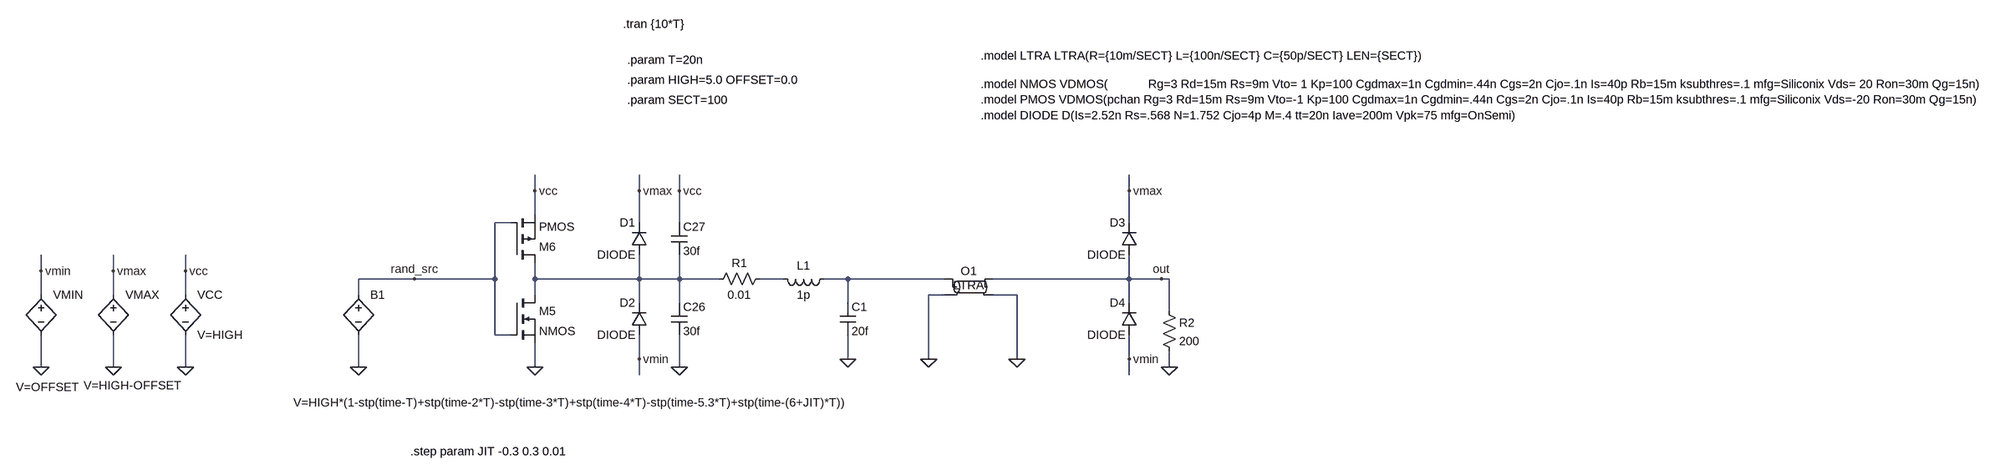
[diagram p0: schematic Test Nonlinearity.asc]
Test Nonlinearity.asc, the LTspice schematic file:
Version 4
SHEET 1 5848 2316
WIRE 384 -240 384 -272
WIRE 592 -240 592 -272
WIRE 672 -240 672 -272
WIRE 1616 -240 1616 -272
WIRE 384 -192 384 -240
WIRE 336 -176 304 -176
WIRE 592 -176 592 -240
WIRE 672 -176 672 -240
WIRE 1616 -176 1616 -240
WIRE -736 -80 -736 -112
WIRE -592 -80 -592 -112
WIRE -448 -80 -448 -112
WIRE 144 -64 32 -64
WIRE 304 -64 304 -176
WIRE 304 -64 144 -64
WIRE 384 -64 384 -96
WIRE 592 -64 592 -112
WIRE 592 -64 384 -64
WIRE 672 -64 672 -112
WIRE 672 -64 592 -64
WIRE 752 -64 672 -64
WIRE 880 -64 832 -64
WIRE 1008 -64 960 -64
WIRE 1248 -64 1008 -64
WIRE 1616 -64 1616 -112
WIRE 1616 -64 1344 -64
WIRE 1680 -64 1616 -64
WIRE 1696 -64 1680 -64
WIRE -736 -32 -736 -80
WIRE -592 -32 -592 -80
WIRE -448 -32 -448 -80
WIRE 32 -32 32 -64
WIRE 384 -32 384 -64
WIRE 1248 -32 1216 -32
WIRE 1392 -32 1344 -32
WIRE 592 -16 592 -64
WIRE 672 -16 672 -64
WIRE 1008 -16 1008 -64
WIRE 1616 -16 1616 -64
WIRE 1696 0 1696 -64
WIRE 304 48 304 -64
WIRE 336 48 304 48
WIRE 592 96 592 48
WIRE 1008 96 1008 48
WIRE 1216 96 1216 -32
WIRE 1392 96 1392 -32
WIRE 1616 96 1616 48
WIRE -736 112 -736 48
WIRE -592 112 -592 48
WIRE -448 112 -448 48
WIRE 32 112 32 48
WIRE 384 112 384 64
WIRE 672 112 672 48
WIRE 1696 112 1696 80
WIRE 592 128 592 96
WIRE 1616 128 1616 96
FLAG 1696 112 0
FLAG -448 112 0
FLAG -448 -80 vcc
FLAG 384 112 0
FLAG 1008 96 0
FLAG 672 112 0
FLAG -592 112 0
FLAG -592 -80 vmax
FLAG -736 112 0
FLAG -736 -80 vmin
FLAG 1216 96 0
FLAG 1392 96 0
FLAG 592 -240 vmax
FLAG 592 96 vmin
FLAG 384 -240 vcc
FLAG 672 -240 vcc
FLAG 1616 -240 vmax
FLAG 1616 96 vmin
FLAG 144 -64 rand_src
FLAG 1680 -64 out
FLAG 32 112 0
SYMBOL nmos 336 -32 R0
SYMATTR InstName M5
SYMBOL pmos 336 -96 M180
SYMATTR InstName M6
SYMBOL ind 976 -80 R90
WINDOW 0 5 56 VBottom 2
WINDOW 3 32 56 VTop 2
SYMATTR InstName L1
SYMATTR Value 1p
SYMBOL cap 992 -16 R0
SYMATTR InstName C1
SYMATTR Value 20f
SYMBOL res 848 -80 R90
WINDOW 0 0 56 VBottom 2
WINDOW 3 32 56 VTop 2
SYMATTR InstName R1
SYMATTR Value 0.01
SYMBOL diode 608 -112 R180
WINDOW 0 24 64 Left 2
WINDOW 3 24 0 Left 2
SYMATTR InstName D1
SYMATTR Value DIODE
SYMBOL cap 656 -16 R0
SYMATTR InstName C26
SYMATTR Value 30f
SYMBOL cap 656 -176 R0
SYMATTR InstName C27
SYMATTR Value 30f
SYMBOL ltline 1296 -48 R0
WINDOW 3 0 12 Bottom 2
SYMATTR InstName O1
SYMBOL bv -448 -48 R0
SYMATTR InstName VCC
SYMATTR Value V=HIGH
SYMBOL bv -592 -48 R0
WINDOW 3 -59 197 Left 2
SYMATTR Value V=HIGH-OFFSET
SYMATTR InstName VMAX
SYMBOL bv -736 -48 R0
WINDOW 3 -50 200 Left 2
SYMATTR Value V=OFFSET
SYMATTR InstName VMIN
SYMBOL diode 608 48 R180
WINDOW 0 24 64 Left 2
WINDOW 3 24 0 Left 2
SYMATTR InstName D2
SYMATTR Value DIODE
SYMBOL res 1680 -16 R0
SYMATTR InstName R2
SYMATTR Value 200
SYMBOL diode 1632 -112 R180
WINDOW 0 24 64 Left 2
WINDOW 3 24 0 Left 2
SYMATTR InstName D3
SYMATTR Value DIODE
SYMBOL diode 1632 48 R180
WINDOW 0 24 64 Left 2
WINDOW 3 24 0 Left 2
SYMATTR InstName D4
SYMATTR Value DIODE
SYMBOL bv 32 -48 R0
WINDOW 3 -130 231 Left 2
SYMATTR InstName B1
SYMATTR Value V=HIGH*(1-stp(time-T)+stp(time-2*T)-stp(time-3*T)+stp(time-4*T)-stp(time-5.3*T)+stp(time-(6+JIT)*T))
TEXT 1320 -656 Left 2 !.model LTRA LTRA(R={10m/SECT} L={100n/SECT} C={50p/SECT} LEN={SECT})
TEXT 1320 -600 Left 2 !.model NMOS VDMOS(            Rg=3 Rd=15m Rs=9m Vto= 1 Kp=100 Cgdmax=1n Cgdmin=.44n Cgs=2n Cjo=.1n Is=40p Rb=15m ksubthres=.1 mfg=Siliconix Vds= 20 Ron=30m Qg=15n)\n.model PMOS VDMOS(pchan Rg=3 Rd=15m Rs=9m Vto=-1 Kp=100 Cgdmax=1n Cgdmin=.44n Cgs=2n Cjo=.1n Is=40p Rb=15m ksubthres=.1 mfg=Siliconix Vds=-20 Ron=30m Qg=15n)\n.model DIODE D(Is=2.52n Rs=.568 N=1.752 Cjo=4p M=.4 tt=20n Iave=200m Vpk=75 mfg=OnSemi)
TEXT 560 -720 Left 2 !.tran {10*T}
TEXT 568 -648 Left 2 !.param T=20n
TEXT 568 -608 Left 2 !.param HIGH=5.0 OFFSET=0.0
TEXT 568 -568 Left 2 !.param SECT=100
TEXT 136 280 Left 2 !.step param JIT -0.3 0.3 0.01

The netlist it stands for:
* Test Nonlinearity.asc
M5 N001 rand_src 0 0 NMOS
M6 N001 rand_src vcc vcc PMOS
L1 N003 N002 1p
C1 N003 0 20f
R1 N002 N001 0.01
D1 N001 vmax DIODE
C26 N001 0 30f
C27 vcc N001 30f
O1 N003 0 out 0 LTRA
B§VCC vcc 0 V=HIGH
B§VMAX vmax 0 V=HIGH-OFFSET
B§VMIN vmin 0 V=OFFSET
D2 vmin N001 DIODE
R2 out 0 200
D3 out vmax DIODE
D4 vmin out DIODE
B1 rand_src 0 V=HIGH*(1-stp(time-T)+stp(time-2*T)-stp(time-3*T)+stp(time-4*T)-stp(time-5.3*T)+stp(time-(6+JIT)*T))
.model D D
.lib standard.dio
.model NMOS NMOS
.model PMOS PMOS
.lib standard.mos
.model LTRA LTRA(R={10m/SECT} L={100n/SECT} C={50p/SECT} LEN={SECT})
.model NMOS VDMOS(            Rg=3 Rd=15m Rs=9m Vto= 1 Kp=100 Cgdmax=1n Cgdmin=.44n Cgs=2n Cjo=.1n Is=40p Rb=15m ksubthres=.1 mfg=Siliconix Vds= 20 Ron=30m Qg=15n)
.model PMOS VDMOS(pchan Rg=3 Rd=15m Rs=9m Vto=-1 Kp=100 Cgdmax=1n Cgdmin=.44n Cgs=2n Cjo=.1n Is=40p Rb=15m ksubthres=.1 mfg=Siliconix Vds=-20 Ron=30m Qg=15n)
.model DIODE D(Is=2.52n Rs=.568 N=1.752 Cjo=4p M=.4 tt=20n Iave=200m Vpk=75 mfg=OnSemi)
.tran {10*T}
.param T=20n
.param HIGH=5.0 OFFSET=0.0
.param SECT=100
.step param JIT -0.3 0.3 0.01
.backanno
.end